# Altium schematic sheet ADC_SMA_WBC1-1.SchDoc
size A3
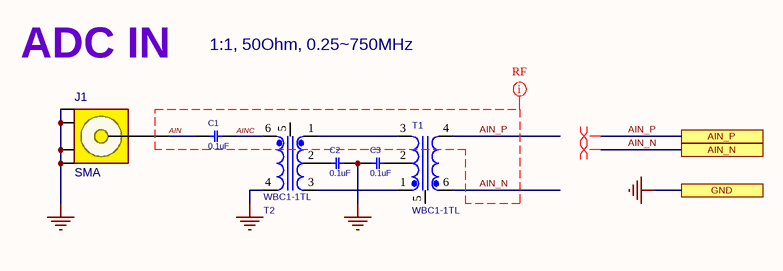
[diagram p0: ADC_SMA_WBC1-1.SchDoc]

## Parts
C1  0.1uF  [C0402]
C2  0.1uF  [C0402]
C3  0.1uF  [C0402]
J1  SMA  [SMA_ST]
T1  WBC1-1TL  [TRNS150_6_450X420]
T2  WBC1-1TL  [TRNS150_6_450X420]

## Ports
AIN_N, AIN_P, GND

## Nets
GND: C2.2 C3.1 J1.2(G1) J1.3(G2) J1.4(G3) J1.5(G4) T2.4(SEC) ; port GND
AIN: C1.1 J1.1(SIG)
AIN_N: T1.6(SECDOT) ; port AIN_N
AIN_P: T1.4(SEC) ; port AIN_P
AINC: C1.2 T2.6(SECDOT)
NetC2_1: C2.1 T2.2(PRICT)
NetC3_2: C3.2 T1.2(PRICT)
NetT1_1: T1.1(PRIDOT) T2.3(PRI)
NetT1_3: T1.3(PRI) T2.1(PRIDOT)

Not connected (* = marked no-connect by the designer): T1 5(NC); T2 5(NC)

## Layout directives
net class RF: AIN, AIN_N, AIN_P, AINC
differential pair: AIN_N, AIN_P

## Notes on the sheet
- (near J1) ADC IN
- 1:1, 50Ohm, 0.25~750MHz
- Title
- Size:
- Date:
- A3
- Number:
- Time:
- Revision:
- Sheet
- of
- File:

## Library data of the parts
C1-C3 = CAP_SMD_MLCC_100n50T: CAP, MLCC; PARAM: X5R, 10%; MANF_P#: GRM155R61E104; MANF: Murata; PARAM2: 25v; ASSEMBLY: ASSEMBLY; PRICE: 10,000:$0.006; VALUE: 0.1uF
J1 = CONN_RF_SMA_ST: CONN, RF, SMA, STRAIGHT; MANF_P#: 142-0701-201; MANF: Johnson; PARAM: 50Ohm, 18GHz; DESC: DESCRIPTION; DIST#: MOUSER; PARAM2: GOLD; ASSEMBLY: ASSEMBLY; PRICE: 2.7$; VALUE: SMA
T1 T2 = WBC1-1TL: RF Transformer, 1:1, 50Ohm, 0.25~750MHz; MANF: Coilcraft; PARAM2: 36mA; MANF_P#: WBC1-1TL; PARAM: 1:1, 50Ohm, 0.25~750MHz; PRICE: 5$; VALUE: WBC1-1TL